# EAGLE schematic stepper_power (EAGLE 7.2.0)
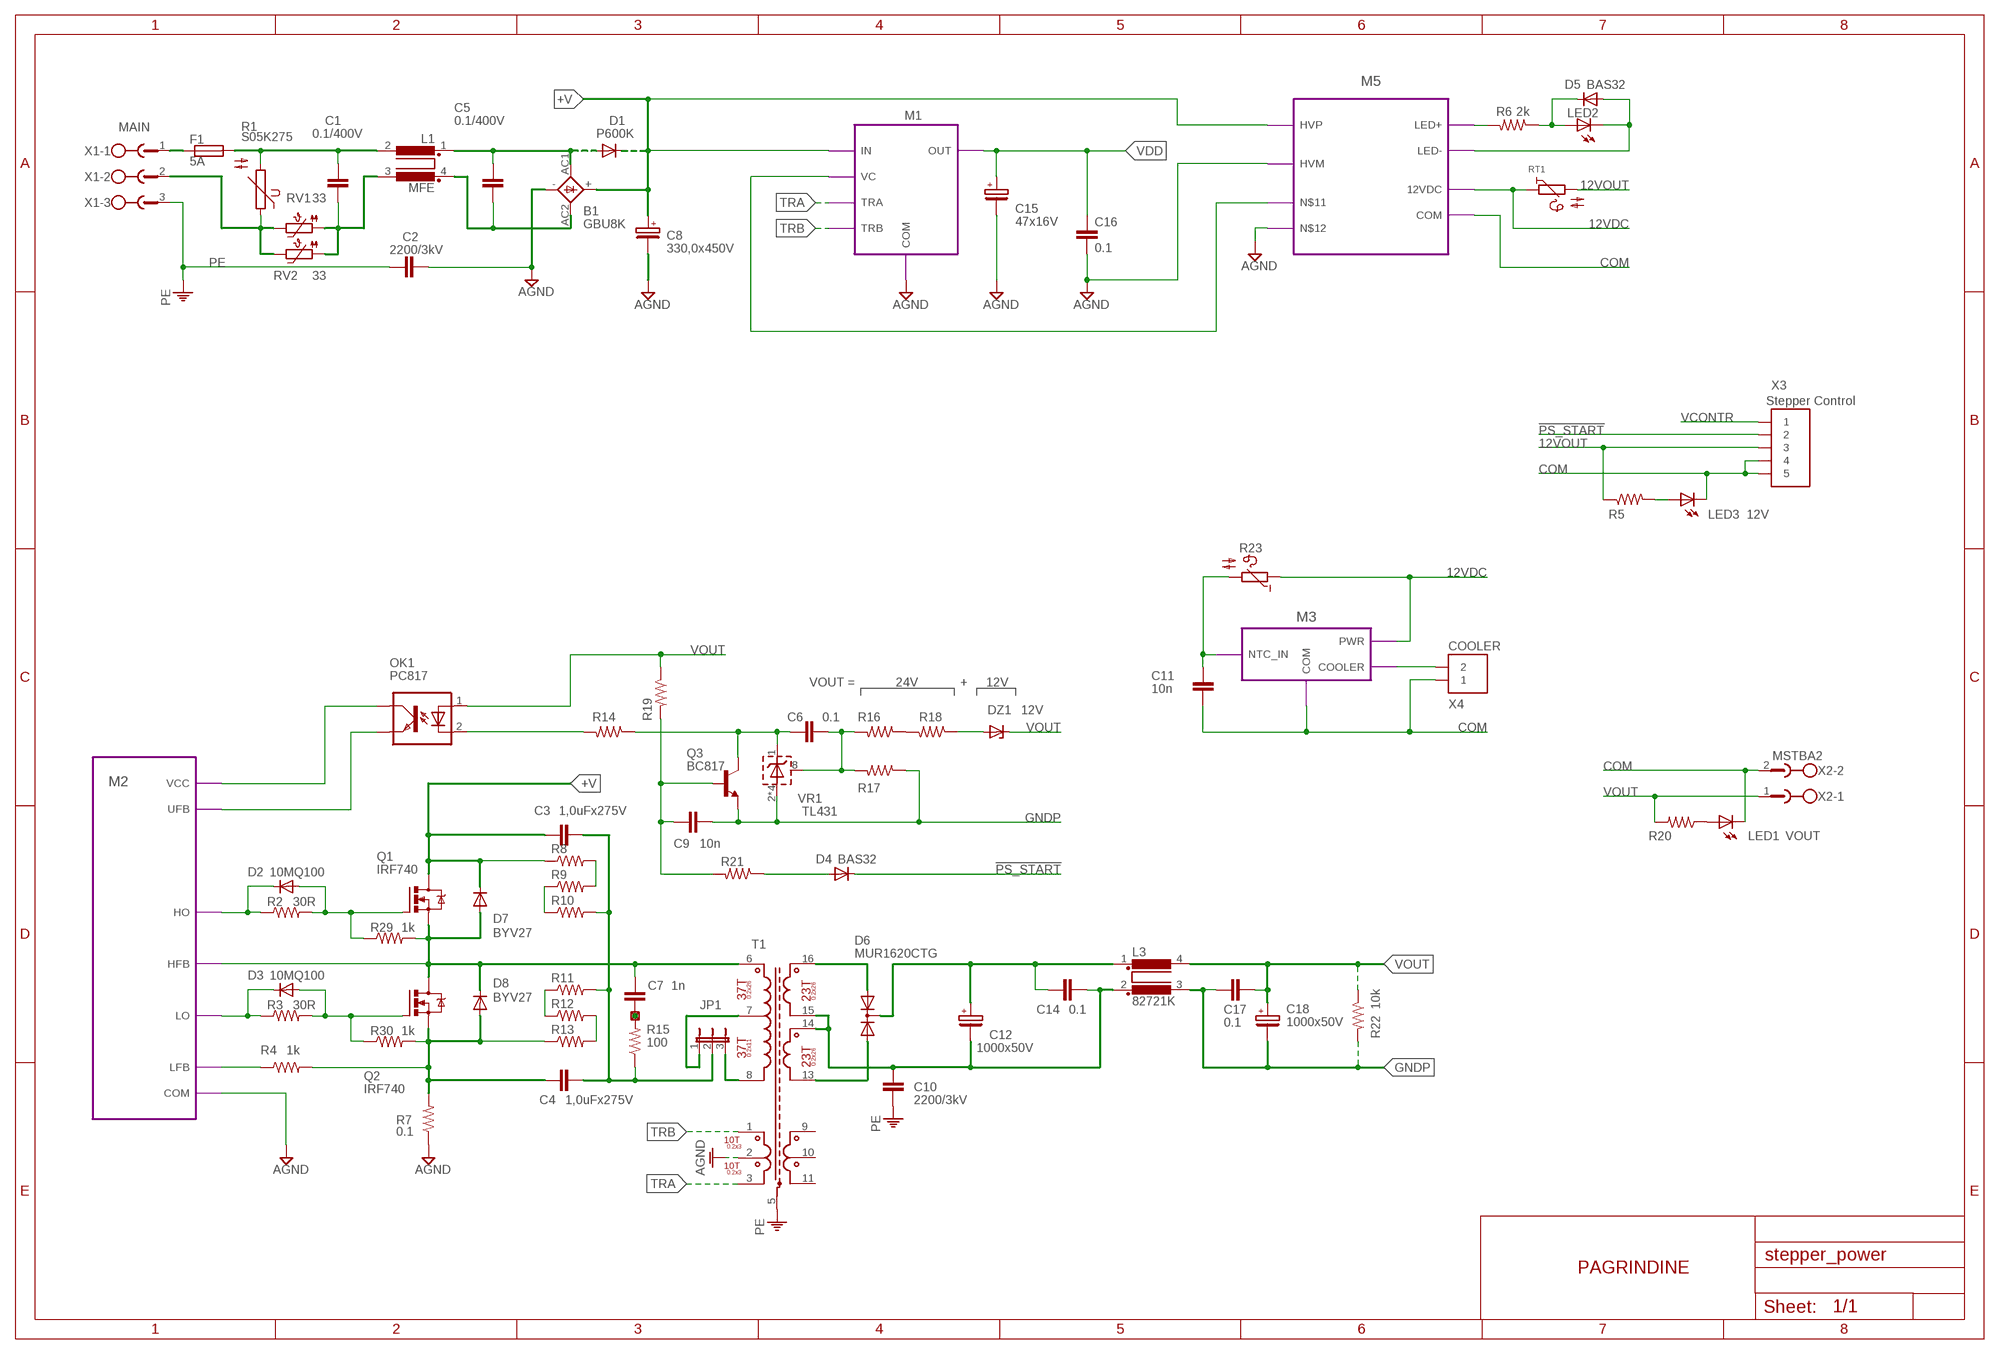
[diagram p0: schematic, sheet 1]

## Parts
B1  GBU8K  GBU4  [GBU4S]
C1  0.1/400V  C-EU102-043X133  [C102-043X133]
C2  2200/3kV  C-EU075-042X103  [C075-042X103]
C3  1,0uFx275V  C-EU225-108X268  [C225-108X268]
C4  1,0uFx275V  C-EU225-108X268  [C225-108X268]
C5  0.1/400V  C-EU102-043X133  [C102-043X133]
C6  0.1  C-EUC0805  [C0805]
C7  1n  C-EU075-042X103  [C075-042X103]
C8  330,0x450V  CPOL-EUE10-25H  [EB25H]
C9  10n  C-EUC0805  [C0805]
C10  2200/3kV  C-EU075-042X103  [C075-042X103]
C11  10n  C-EUC0805  [C0805]
C12  1000x50V  CPOL-EUE5-13  [E5-13]
C14  0.1  C-EU075-042X103  [C075-042X103]
C15  47x16V  CPOL-EUE2,5-6E  [E2,5-6E]
C16  0.1  C-EUC0805  [C0805]
C17  0.1  C-EU075-042X103  [C075-042X103]
C18  1000x50V  CPOL-EUE5-13  [E5-13]
D1  P600K  DIODE-P6-15-1  [P6-15-1]
D2  10MQ100  DIODE-DO214AA  [DO214AA]
D3  10MQ100  DIODE-DO214AA  [DO214AA]
D4  BAS32  DIODE-MINIMELF  [MINIMELF]
D5  BAS32  DIODE-MINIMELF  [MINIMELF]
D6  MUR1620CTG  DIODE-2AC|CATO220V  [TO220ABS]
D7  BYV27  [SOD57-10]
D8  BYV27  [SOD57-10]
DZ1  12V  ZENER-DIODESOD80C  [SOD80C]
F1  5A  SH22,5A  [SH22,5A]
JP1  JUMPER-3PTH  [1X03]
L1  MFE  [MFE]
L3  82721K  [82721K]
LED1  VOUT  LEDB155  [Q62902-B155]
LED2  12V  LEDCHIPLED_0805  [CHIPLED_0805]
LED3  12V  LEDCHIPLED_0805  [CHIPLED_0805]
OK1  PC817  [DIL04]
P1  SPECIAL_PADSD1.0  [LP_D1.0]
Q1  IRF740  IRF740V  [TO220BV]
Q2  IRF740  IRF740V  [TO220BV]
Q3  BC817  BC817-16SMD  [SOT23-BEC]
R1  S05K275  [S05K275]
R2  30R  R-US_R0805  [R0805]
R3  30R  R-US_R0805  [R0805]
R4  1k  R-US_R0805  [R0805]
R5  R-US_R0805  [R0805]
R6  2k  R-US_R1206  [R1206]
R7  0.1  R-US_0411/15  [0411/15]
R8  R-US_R0805  [R0805]
R9  R-US_R0805  [R0805]
R10  R-US_R0805  [R0805]
R11  R-US_R0805  [R0805]
R12  R-US_R0805  [R0805]
R13  R-US_R0805  [R0805]
R14  R-US_R0805  [R0805]
R15  100  R-US_0817/22  [P0817/22]
R16  R-US_R0805  [R0805]
R17  R-US_R0805  [R0805]
R18  R-US_R0805  [R0805]
R19  R-US_R0805  [R0805]
R20  R-US_R0805  [R0805]
R21  R-US_R0805  [R0805]
R22  10k  R-US_0204/7  [0204/7]
R23  NTC640  [P640]
R29  1k  R-US_R0805  [R0805]
R30  1k  R-US_R0805  [R0805]
RT1  PTC/X40  [X40]
RV1  33  PTC-TABL_10  [TABLETE_10]
RV2  33  PTC-TABL_10  [TABLETE_10]
T1  STEPPER_POWER_SUPPLY_1  [ETD-39-K-H-16P]
VR1  TL431  TL431D  [SO-08]
X1  MAIN  MSTBA3  [MSTBA3]
X2  MSTBA2  [MSTBA2]
X3  Stepper Control  5PIN_NS25-W5P  [6410-05]
X4  COOLER  2PIN_NS25-W2P  [6410-02]

## Module instances
M1 = M1
M2 = M2
M5 = M5
M3 = M3

## Nets
12VDC: R23.1 RT1.1 ; port M3.PWR M5.12VDC
12VOUT: R5.1 RT1.2 X3.3
!PS_START: D4.C X3.2
+V [power++]: B1.+ C3.1 C8.+ D1.C D7.C Q1.D R8.1 ; port M5.HVP M1.IN
AGND: B1.- C2.2 C8.- C15.- C16.2 R7.1 T1.2(P2C) ; port M1.COM M5.HVM M2.COM M5.N$12
COM [power++]: C11.2 LED1.K(C) LED3.C X2.2 X3.4 X3.5 X4.1 ; port M5.COM M3.COM
FB: R4.1 ; port M2.LFB
GNDP [power++]: C9.1 C17.2 C18.- L3.3 Q3.E R17.1 R22.2 VR1.2(A) VR1.3(A) VR1.6(A) VR1.7(A)
HO [power++]: D2.C R2.1 ; port M2.HO
LO [power]: D3.C R3.1 ; port M2.LO
N$1: OK1.2(C) R14.2
N$2: R11.1 R12.1
N$3: R6.2 ; port M5.LED+
N$4 [power++]: C3.2 C4.2 JP1.2 R10.2 R11.2 R15.1
N$5: C7.2 P1.P$1 R15.2
N$6: D3.A Q2.G R3.2 R30.1
N$7: D6.3(A2) T1.16(P4A)
N$8: D6.1(A1) T1.13(P5B)
N$9: C6.2 R16.2 R17.2 VR1.8(R)
N$10 [power++]: DZ1.A R18.1
N$12: C10.2 C12.- C14.1 L3.2 T1.14(P5A) T1.15(P4B)
N$13: C9.2 Q3.B R19.2 R21.2
N$14 [power++]: C12.+ C14.2 D6.2(C) L3.1
N$15: LED3.A R5.2
N$16: D2.A Q1.G R2.2 R29.1
N$17: D4.A R21.1
N$18: C11.1 R23.2 ; port M3.NTC_IN
N$19: R12.2 R13.2
N$20: JP1.1 T1.7
N$21: X4.2 ; port M3.COOLER
N$22: JP1.3 T1.8(P1B)
N$24: D5.C LED2.A R6.1
N$25: D5.A LED2.C ; port M5.LED-
N$26: R9.1 R10.1
N$27: R8.2 R9.2
N$28: LED1.A R20.1
N$29 [power++]: C1.2 L1.3 RV1.1 RV2.1
N$30 [power++]: C1.1 F1.2 L1.2 R1.2
N$31 [power++]: R1.1 RV1.2 RV2.2 X1.2
N$32 [power++]: F1.1 X1.1
N$33: C6.1 Q3.C R14.1 VR1.1(C)
N$34: B1.AC2(AC1) C5.2 L1.4
N$36: R16.1 R18.2
N$37 [power]: C4.1 D8.A Q2.S R4.2 R7.2 R13.1 R30.2
N$43 [power++]: B1.AC1(AC2) C5.1 D1.A L1.1
OKE [power]: OK1.3(EMIT) ; port M2.UFB
PE [power++]: C2.1 C10.1 T1.5(PE) X1.3
TRA [power]: T1.3(P2B) ; port M1.TRA
TRB [power]: T1.1(P2A) ; port M1.TRB
VB [power++]: C7.1 D7.A D8.C Q1.S Q2.D R29.2 T1.6(P1A) ; port M2.HFB
VCONTR: X3.1
VCT [power]: port M5.N$11 M1.VC
VDD [power]: C15.+ C16.1 OK1.4(COL) ; port M2.VCC M1.OUT
VOUT [power++]: C17.1 C18.+ DZ1.C L3.4 OK1.1(A) R19.1 R20.2 R22.1 X2.1
Unconnected: T1.9(P3A) T1.10(P3C) T1.11(P3B)

## Notes on the sheet
- VOUT = | 24V | + | 12V
- 37T | 0.2x26 | 0.2x26
- 23T
- 37T | 0.2x11
- 23T | 0.2x26
- 10T
- 0.2x3
- 10T
- 0.2x3
- PAGRINDINE

## Library data of the parts
B1 = rectifier:GBU4: GENERAL INSTRUMENT RECTIFIER
C1-C7 C9-C11 C14 C16 C17 = rcl:C-EU: Kondensatorius
C8 C12 C15 C18 = rcl:CPOL-EU: POLARIZED CAPACITOR, European symbol
D1-D5 = diode:DIODE-: DIODE
D6 = diode:DIODE-2AC|CA: Dual DIODE Anode-Cathode|Cathode-Anode
D7 D8 = diode:BYV27: DIODE ultra fast
DZ1 = diode:ZENER-DIODE: Z-Diode
F1 = fuse:SH22,5A: FUSE HOLDER grid 22,5mm, isolated cap OGN0031 8201, Schurter (Buerklin)
JP1 = SparkFun:JUMPER-3
L1 = inductors:MFE: FILTER
L3 = inductors:82721K: FILTER
LED1-LED3 = led:LED: LED OSRAM: - CHIPLED LG R971, LG N971, LY N971, LG Q971, LY Q971, LO R971, LY R971 LH N974, LH R974 LS Q976, LO Q976, LY Q976 LO Q996 - Hyper CHIPLED LW Q18S LB Q993, LB Q99A, LB R99A - SideLED LS A670, LO A670, LY A670, LG A670, LP A670 LB A673, LV A673, LT A673, LW A673 LH A674 LY A675 LS A676, LA A676, LO A676, LY A676, LW A676 LS A679, LY A679, LG A679 - Hyper Micro SIDELED® LS Y876, LA Y876, LO Y876, LY Y876 LT Y87S - SmartLED LW L88C, LW L88S LB L89C, LB L89S, LG L890 LS L89K, LO L89K, LY L89K LS L896, LA L896, LO L896, LY L896 - TOPLED LS T670, LO T670, LY T670, LG T670, LP T670 LSG T670, LSP T670, LSY T670, LOP T670, LYG T670 LG T671, LOG T671, LSG T671 LB T673, LV T673, LT T673, LW T673 LH T674 LS T676, LA T676, LO T676, LY T676, LB T676, LH T676, LSB T676, LW T676 LB T67C, LV T67C, LT T67C, LS T67K, LO T67K, LY T67K, LW E67C LS E67B, LA E67B, LO E67B, LY E67B, LB E67C, LV E67C, LT E67C LW T67C LS T679, LY T679, LG T679 LS T770, LO T770, LY T770, LG T770, LP T770 LB T773, LV T773, LT T773, LW T773 LH T774 LS E675, LA E675, LY E675, LS T675 LS T776, LA T776, LO T776, LY T776, LB T776 LHGB T686 LT T68C, LB T68C - Hyper Mini TOPLED® LB M676 - Mini TOPLED Santana® LG M470 LS M47K, LO M47K, LY M47K Source: http://www.osram.convergy.de LUXEON: - LUMILED® LXK2-PW12-R00, LXK2-PW12-S00, LXK2-PW14-U00, LXK2-PW14-V00 LXK2-PM12-R00, LXK2-PM12-S00, LXK2-PM14-U00 LXK2-PE12-Q00, LXK2-PE12-R00, LXK2-PE12-S00, LXK2-PE14-T00, LXK2-PE14-U00 LXK2-PB12-K00, LXK2-PB12-L00, LXK2-PB12-M00, LXK2-PB14-N00, LXK2-PB14-P00, LXK2-PB14-Q00 LXK2-PR12-L00, LXK2-PR12-M00, LXK2-PR14-Q00, LXK2-PR14-R00 LXK2-PD12-Q00, LXK2-PD12-R00, LXK2-PD12-S00 LXK2-PH12-R00, LXK2-PH12-S00 LXK2-PL12-P00, LXK2-PL12-Q00, LXK2-PL12-R00 Source: www.luxeon.com KINGBRIGHT: KA-3528ASYC Source: www.kingbright.com
OK1 = optocoupler:PC817: SHARP OPTO COUPLER
P1 = misc:SPECIAL_PADS
Q1 Q2 = transistor-power:IRF740: N-CHANNEL MOS FET
Q3 = transistor-npn:BC817*: NPN Transistor
R1 = varistor:S05K275: VARISTOR
R2-R5 R8-R14 R16-R21 R29 R30 = rcl:R-US_: Rezistorius; PACK_TYPE: SMD
R6 = rcl:R-US_: Rezistorius; PACK_TYPE: SMD; VENT_CODE: ---
R7 R15 R22 = rcl:R-US_: Rezistorius
R23 = ptc-ntc:NTC640: PHILIPS NTC
RT1 = descreet:PTC
RV1 RV2 = ptc-ntc:PTC-: Positive Temperature Coefficient Resistor (PTC) termistor Philips KTY81-210 - KTY81-252 Source: 153627-da-01-en-Temperatur-Sensor_KTY10-6_Philips.pdf
T1 = trafo:STEPPER_POWER_SUPPLY_1
VR1 = v-reg:TL431*: VOLTAGE REGULATOR
X1 = con-phoenix-508:MSTBA3: PHOENIX
X2 = con-phoenix-508:MSTBA2: PHOENIX
X3 = connectors:5PIN_
X4 = connectors:2PIN_

## Module M1
Ports: IN(pwr) COM(pas) OUT(out) TRA(pwr) TRB(pwr) VC(in)
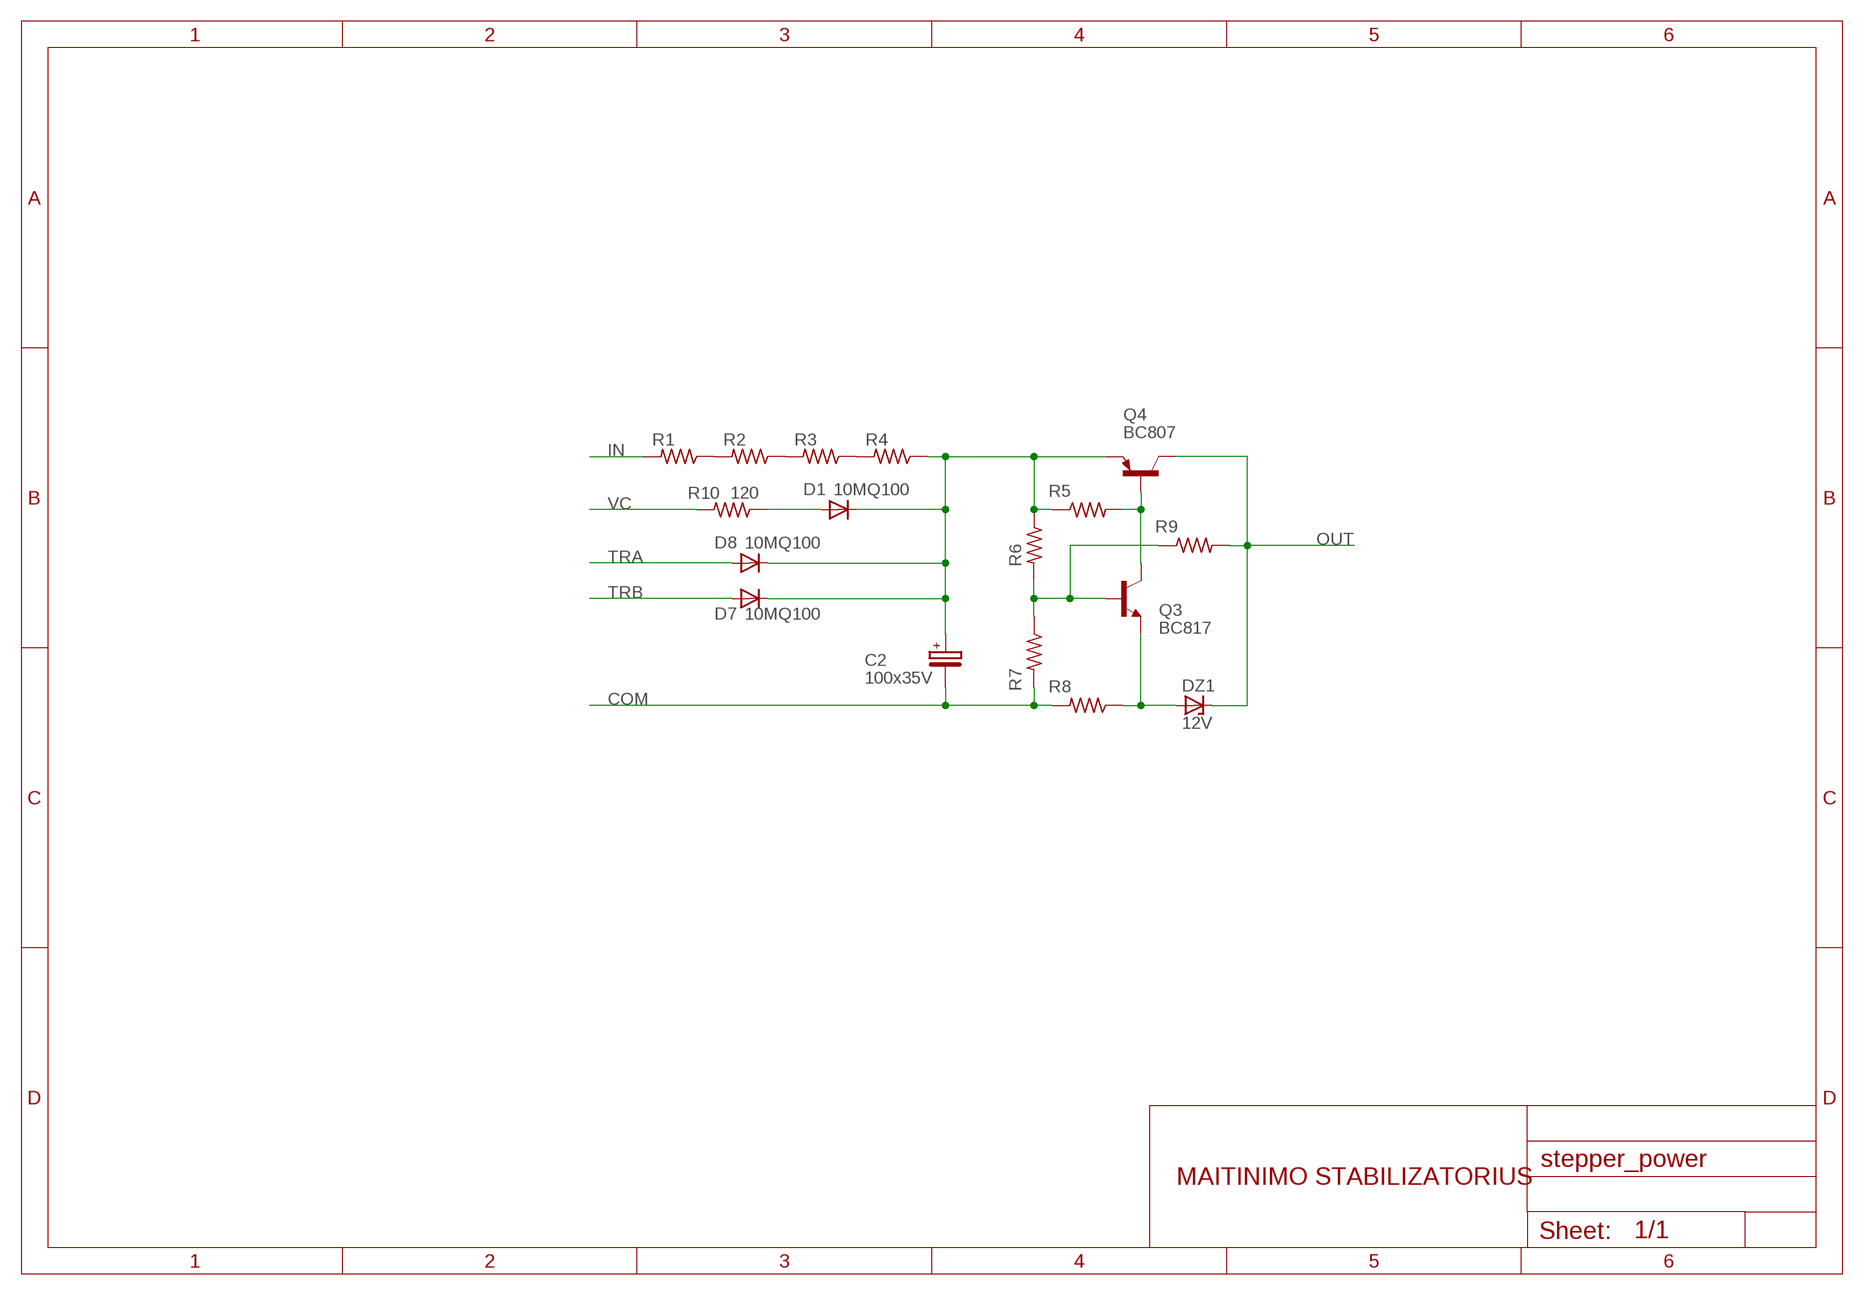
[diagram p1: schematic, module M1, sheet 1]

### Parts
C2  100x35V  CPOL-EUE3.5-8  [E3,5-8]
D1  10MQ100  DIODE-DO214AA  [DO214AA]
D7  10MQ100  DIODE-DO214AA  [DO214AA]
D8  10MQ100  DIODE-DO214AA  [DO214AA]
DZ1  12V  ZENER-DIODESOD80C  [SOD80C]
Q3  BC817  BC817-16SMD  [SOT23-BEC]
Q4  BC807  BC807-16SMD  [SOT23-BEC]
R1  R-US_R0805  [R0805]
R2  R-US_R0805  [R0805]
R3  R-US_R0805  [R0805]
R4  R-US_R0805  [R0805]
R5  R-US_R0805  [R0805]
R6  R-US_R0805  [R0805]
R7  R-US_R0805  [R0805]
R8  R-US_R0805  [R0805]
R9  R-US_R0805  [R0805]
R10  120  R-US_R1206  [R1206]

### Nets
COM: C2.- R7.2 R8.2
IN: R1.2
N$1 [power]: D1.A R10.1
N$2: Q3.B R6.2 R7.1 R9.1
N$3: DZ1.A Q3.E R8.1
N$4: Q3.C Q4.B R5.2
N$5: R3.1 R4.2
N$6 [power]: C2.+ D1.C D7.C D8.C Q4.E R4.1 R5.1 R6.1
N$8: R1.1 R2.2
N$9: R2.1 R3.2
OUT [power]: DZ1.C Q4.C R9.2
TRA: D8.A
TRB: D7.A
VC [power]: R10.2

### Notes on the sheet
- MAITINIMO STABILIZATORIUS

### Library data of the parts
C2 = rcl:CPOL-EU: POLARIZED CAPACITOR, European symbol
D1 D7 D8 = diode:DIODE-: DIODE
DZ1 = diode:ZENER-DIODE: Z-Diode
Q3 = transistor-npn:BC817*: NPN Transistor
Q4 = transistor-pnp:BC807*: PNP Transistror
R1-R9 = rcl:R-US_: Rezistorius; PACK_TYPE: SMD
R10 = rcl:R-US_: Rezistorius; PACK_TYPE: SMD; VENT_CODE: ---

## Module M2
Ports: UFB(in) HFB(in) HO(out) LO(out) LFB(in) COM(pas) VCC(pwr)
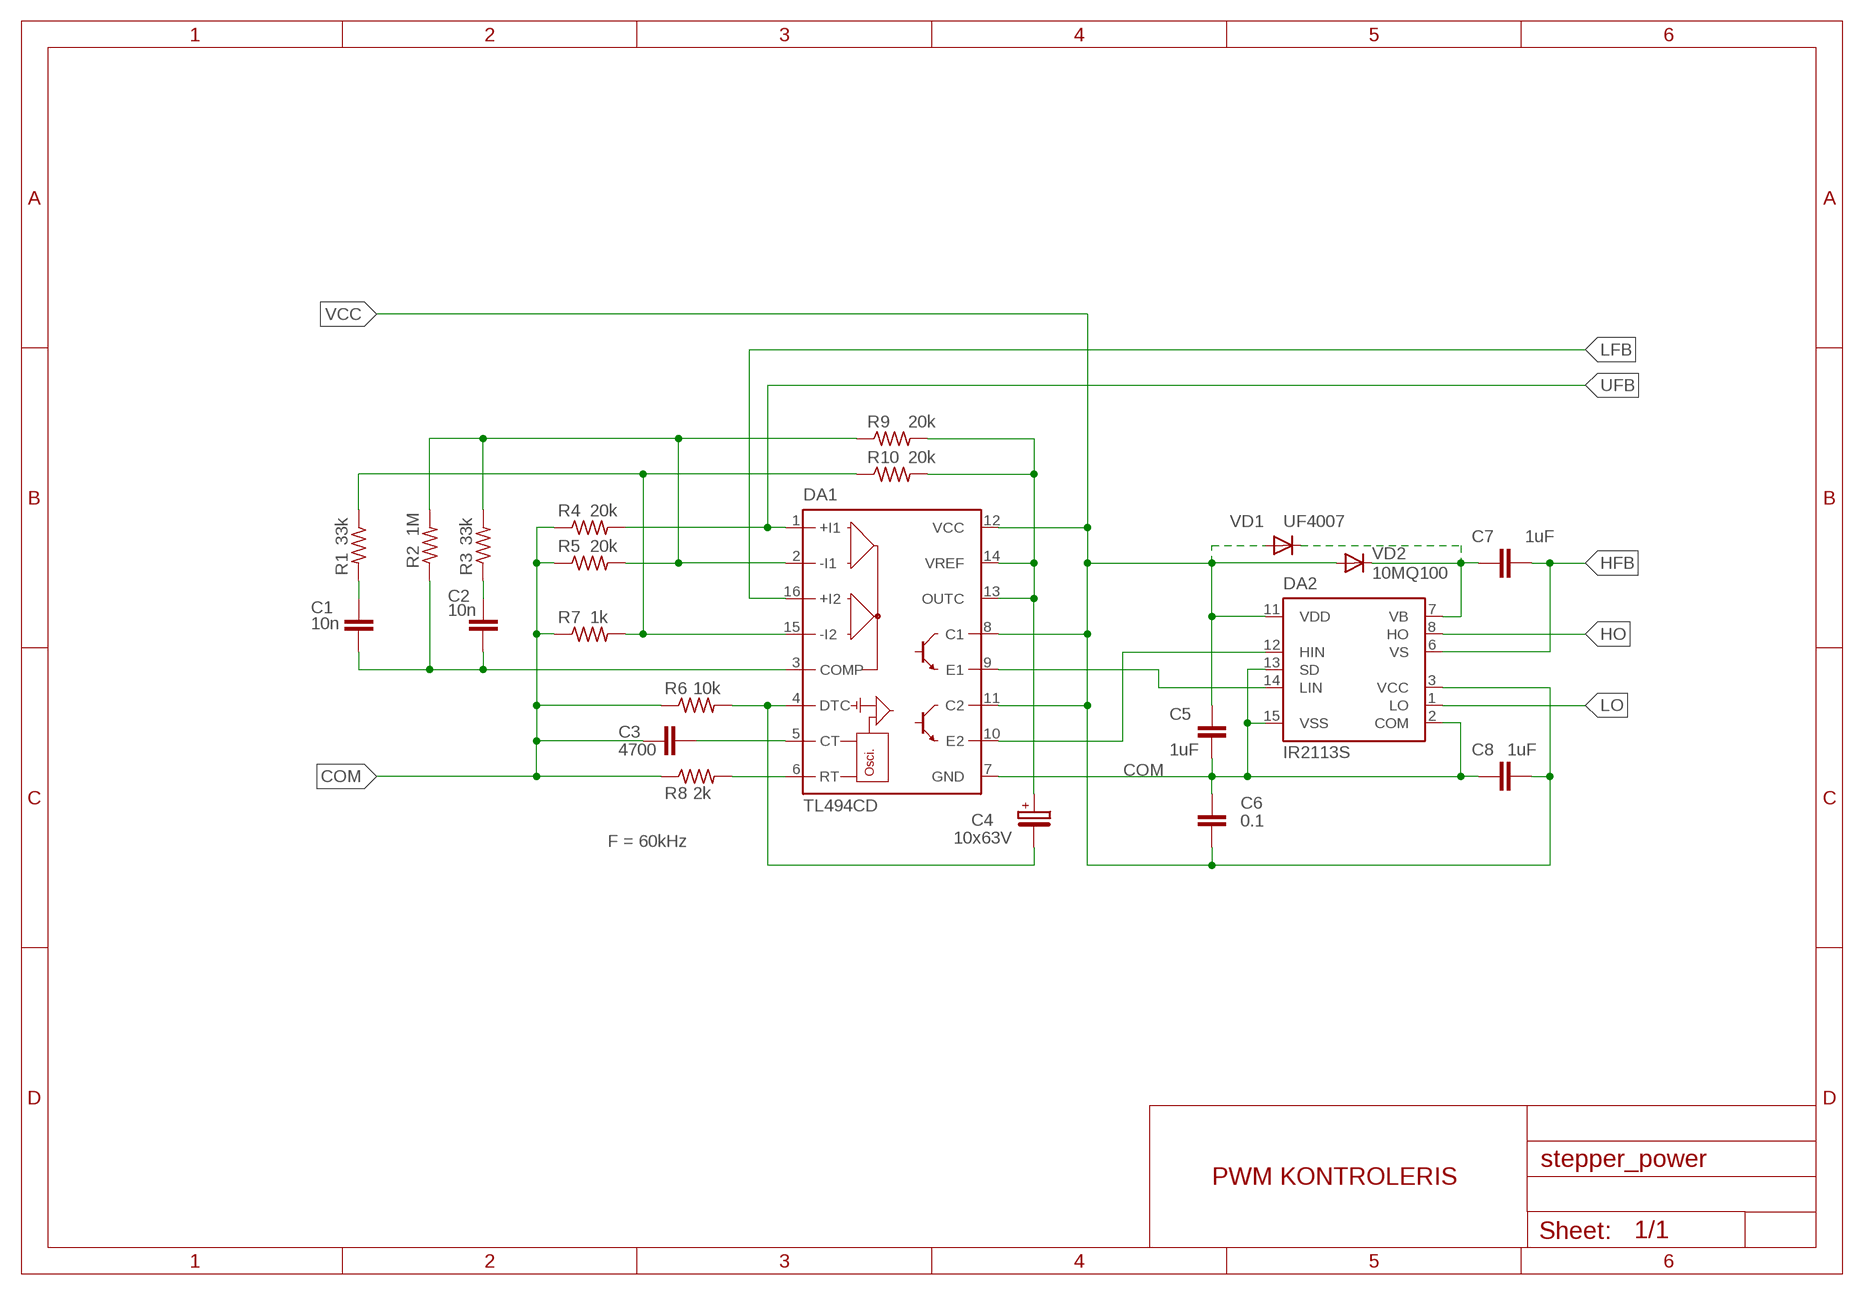
[diagram p2: schematic, module M2, sheet 1]

### Parts
C1  10n  C-EUC0805  [C0805]
C2  10n  C-EUC0805  [C0805]
C3  4700  C-EUC0805  [C0805]
C4  10x63V  CPOL-EUE2-5  [E2-5]
C5  1uF  C-EUC1206  [C1206]
C6  0.1  C-EUC0805  [C0805]
C7  1uF  C-EUC1206  [C1206]
C8  1uF  C-EUC1206  [C1206]
DA1  TL494CD  [SO16]
DA2  IR2113S  [SO16L]
R1  33k  R-US_R0805  [R0805]
R2  1M  R-US_R0805  [R0805]
R3  33k  R-US_R0805  [R0805]
R4  20k  R-US_R0805  [R0805]
R5  20k  R-US_R0805  [R0805]
R6  10k  R-US_R0805  [R0805]
R7  1k  R-US_R0805  [R0805]
R8  2k  R-US_R0805  [R0805]
R9  20k  R-US_R0805  [R0805]
R10  20k  R-US_R0805  [R0805]
VD1  UF4007  DIODE-DO41-10  [DO41-10]
VD2  10MQ100  DIODE-DO214AC  [DO214AC]

### Nets
COM: C3.2 C5.2 C6.1 C8.2 DA1.7(GND) DA2.2(COM) DA2.13(SD) DA2.15(VSS) R4.1 R5.1 R6.1 R7.1 R8.1
HFB [power++]: C7.2 DA2.6(VS)
HO [power++]: DA2.8(HO)
LFB: DA1.16(+I2)
LO [power]: DA2.1(LO)
N$1: DA1.9(E1) DA2.14(LIN)
N$2: DA1.10(E2) DA2.12(HIN)
N$3 [power++]: C7.1 DA2.7(VB) VD1.C VD2.C
N$4: DA1.6(RT) R8.2
N$5: C3.1 DA1.5(CT)
N$6: C1.1 R1.2
N$7: C1.2 C2.1 DA1.3(COMP) R2.1
N$8: DA1.2(-I1) R2.2 R3.2 R5.2 R9.1
N$9: C4.+ DA1.13(OUTC) DA1.14(VREF) R9.2 R10.2
N$10: C2.2 R3.1
N$11: DA1.15(-I2) R1.1 R7.2 R10.1
N$12: C4.- DA1.4(DTC) R6.2
UFB [power]: DA1.1(+I1) R4.2
VCC [power]: C5.1 C6.2 C8.1 DA1.8(C1) DA1.11(C2) DA1.12(VCC) DA2.3(VCC) DA2.11(VDD) VD1.A VD2.A

### Notes on the sheet
- F = 60kHz
- PWM KONTROLERIS

### Library data of the parts
C1-C3 C5-C8 = rcl:C-EU: Kondensatorius
C4 = rcl:CPOL-EU: POLARIZED CAPACITOR, European symbol
DA1 = linear:TL494*: SWITCHMODE Pulse Width Modulation Control Circuit NCV494B http://onsemi.com tl494-d.pdf
DA2 = ir:IR211*
R1-R10 = rcl:R-US_: Rezistorius; PACK_TYPE: SMD
VD1 VD2 = diode:DIODE-: DIODE

## Module M5
Ports: HVP(pwr) HVM(pwr) 12VDC(pwr) COM(pwr) N$12(out) N$11(out) LED+(out) LED-(out)
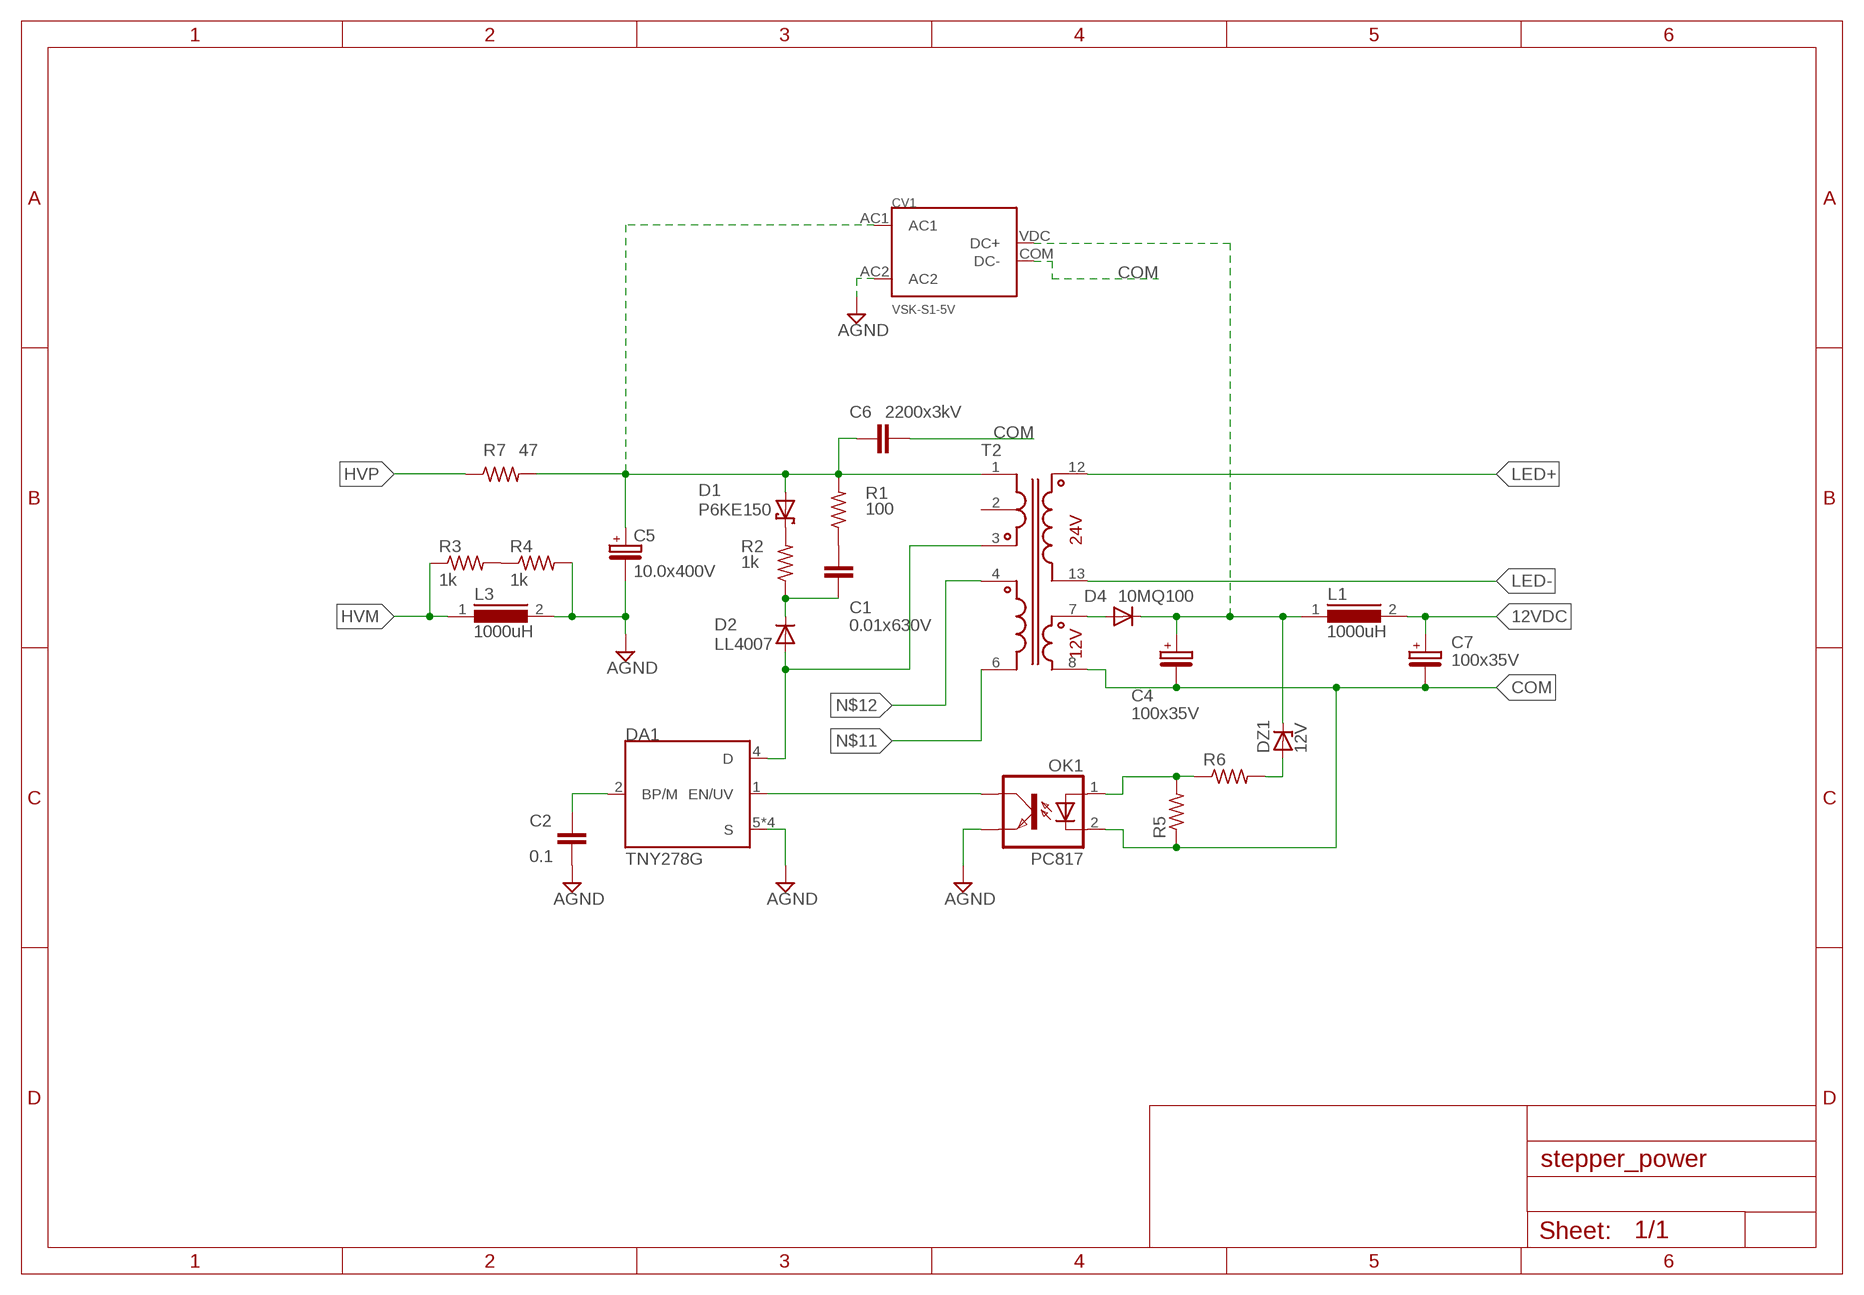
[diagram p3: schematic, module M5, sheet 1]

### Parts
C1  0.01x630V  C-EU102-043X133  [C102-043X133]
C2  0.1  C-EUC0805  [C0805]
C4  100x35V  CPOL-EUE3.5-8  [E3,5-8]
C5  10.0x400V  CPOL-EUE5-10.5  [E5-10,5]
C6  2200x3kV  C-EU075-042X103  [C075-042X103]
C7  100x35V  CPOL-EUE3.5-8  [E3,5-8]
CV1  VSK-S1-5V  VSK-S1  [VSK-S1]
D1  P6KE150  P6KEXX  [DO41-10]
D2  LL4007  DIODE-MELF-MLL41  [MELF-MLL41]
D4  10MQ100  DIODE-DO214AC  [DO214AC]
DA1  TNY278G  TNY278  [DIP8_1]
DZ1  12V  ZENER-DIODESOD80C  [SOD80C]
L1  1000uH  INDUCTOR  [PLOKSCIAS]
L3  1000uH  INDUCTOR  [PLOKSCIAS]
OK1  PC817  [DIL04]
R1  100  R-US_0207/7  [0207/7]
R2  1k  R-US_0207/7  [0207/7]
R3  1k  R-US_R1206  [R1206]
R4  1k  R-US_R1206  [R1206]
R5  R-US_R0805  [R0805]
R6  R-US_R0805  [R0805]
R7  47  R-US_0309/12  [0309/12]
T2  750841630  [750841630]

### Nets
12VDC: C7.+ L1.2
AGND: C2.2 C5.- CV1.AC2 DA1.5(S) DA1.6(S) DA1.7(S) DA1.8(S) L3.2 OK1.3(EMIT) R4.2
COM: C4.- C6.2 C7.- CV1.COM(DC-) OK1.2(C) R5.1 T2.8
HVM: L3.1 R3.1
HVP: R7.1
LED+: T2.12
LED-: T2.13
N$1: C1.2 R1.1
N$2: D1.C R2.2
N$3: C5.+ C6.1 CV1.AC1 D1.A R1.2 R7.2 T2.1
N$4: C1.1 D2.C R2.1
N$5: C2.1 DA1.2(BP/M)
N$6: D2.A DA1.4(D) T2.3
N$7: C4.+ CV1.VDC(DC+) D4.C DZ1.C L1.1
N$8: DA1.1(EN/UV) OK1.4(COL)
N$10: D4.A T2.7
N$11: T2.6
N$12: T2.4
N$13: OK1.1(A) R5.2 R6.1
N$15: R3.2 R4.1
N$16: DZ1.A R6.2
Unconnected: T2.2

### Library data of the parts
C1 C2 C6 = rcl:C-EU: Kondensatorius
C4 C5 C7 = rcl:CPOL-EU: POLARIZED CAPACITOR, European symbol
CV1 = descreet:VSK-S1
D1 = diode:P6KEXX: DIODE transient-voltage suppressor
D2 D4 = diode:DIODE-: DIODE
DA1 = linear:TNY278
DZ1 = diode:ZENER-DIODE: Z-Diode
L1 L3 = inductors:INDUCTOR
OK1 = optocoupler:PC817: SHARP OPTO COUPLER
R1 R2 = rcl:R-US_: Rezistorius
R3 R4 = rcl:R-US_: Rezistorius; PACK_TYPE: SMD; VENT_CODE: ---
R5 R6 = rcl:R-US_: Rezistorius; PACK_TYPE: SMD
R7 = rcl:R-US_: Rezistorius; PACK_TYPE: DIP; VENT_CODE: ---
T2 = trafo:750841630

## Module M3
Ports: NTC_IN(in) COM(pas) COOLER(out) PWR(pwr)
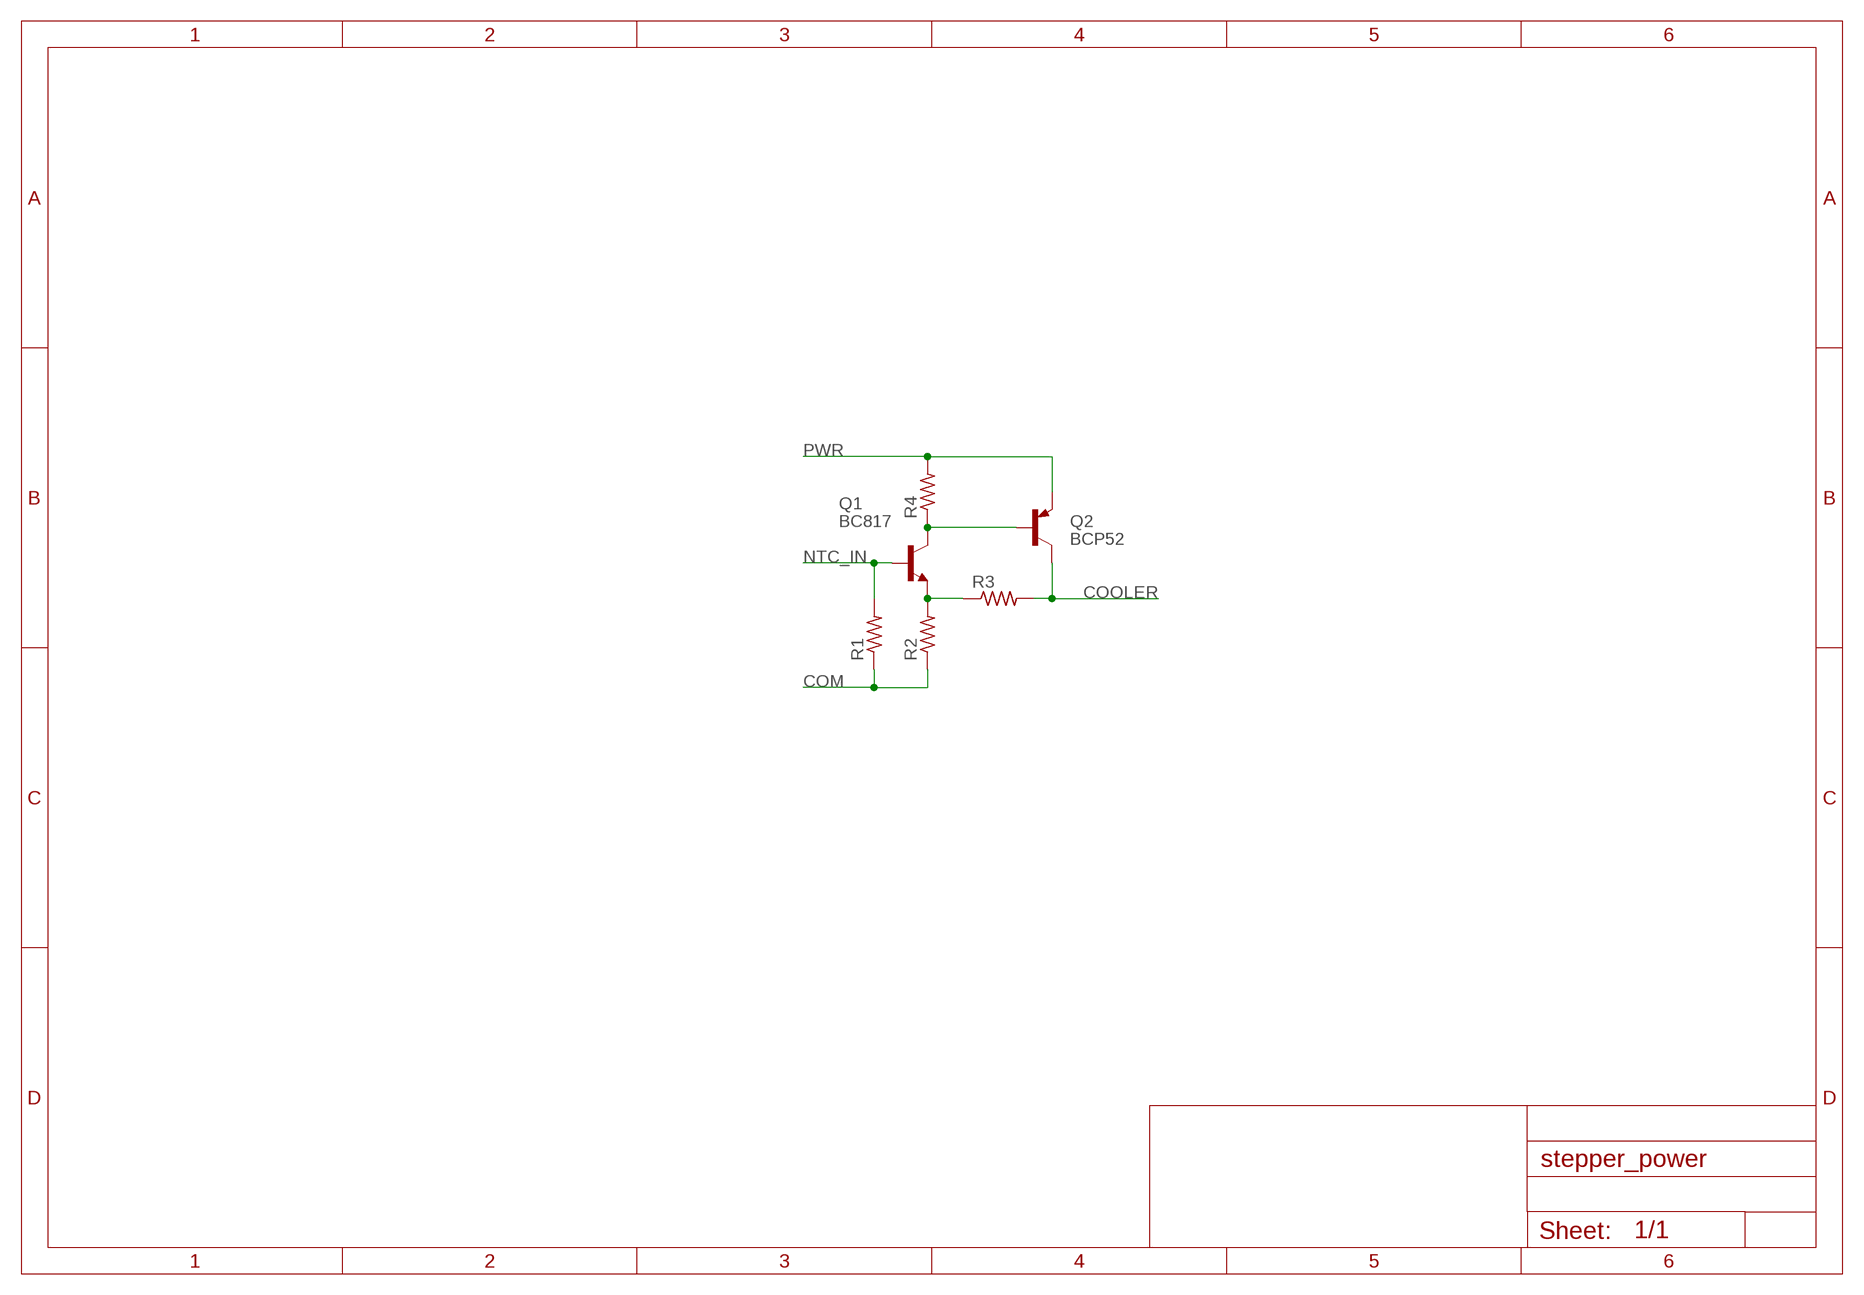
[diagram p4: schematic, module M3, sheet 1]

### Parts
Q1  BC817  BC847ASMD  [SOT23]
Q2  BCP52  [SOT223]
R1  R-US_R0805  [R0805]
R2  R-US_R0805  [R0805]
R3  R-US_R0805  [R0805]
R4  R-US_R0805  [R0805]

### Nets
COM: R1.1 R2.1
COOLER: Q2.2(C) Q2.4(C) R3.2
N$1: Q1.2(E) R2.2 R3.1
N$2: Q1.3(C) Q2.1(B) R4.1
NTC_IN: Q1.1(B) R1.2
PWR: Q2.3(E) R4.2

### Library data of the parts
Q1 = transistor-npn:BC847*: NPN Transistor
Q2 = transistor-pnp:BCP52
R1-R4 = rcl:R-US_: Rezistorius; PACK_TYPE: SMD

## Net classes
1 power: clearance 0.305 mm to class 0, clearance 0.305 mm
2 power++: clearance 0.5 mm